# Altium project ECE453-F22-MCU.PrjPcb (part 2 of 2)

## Sheet 06-GPS.SchDoc
size A; SheetNumber: 6; SheetTotal: 10
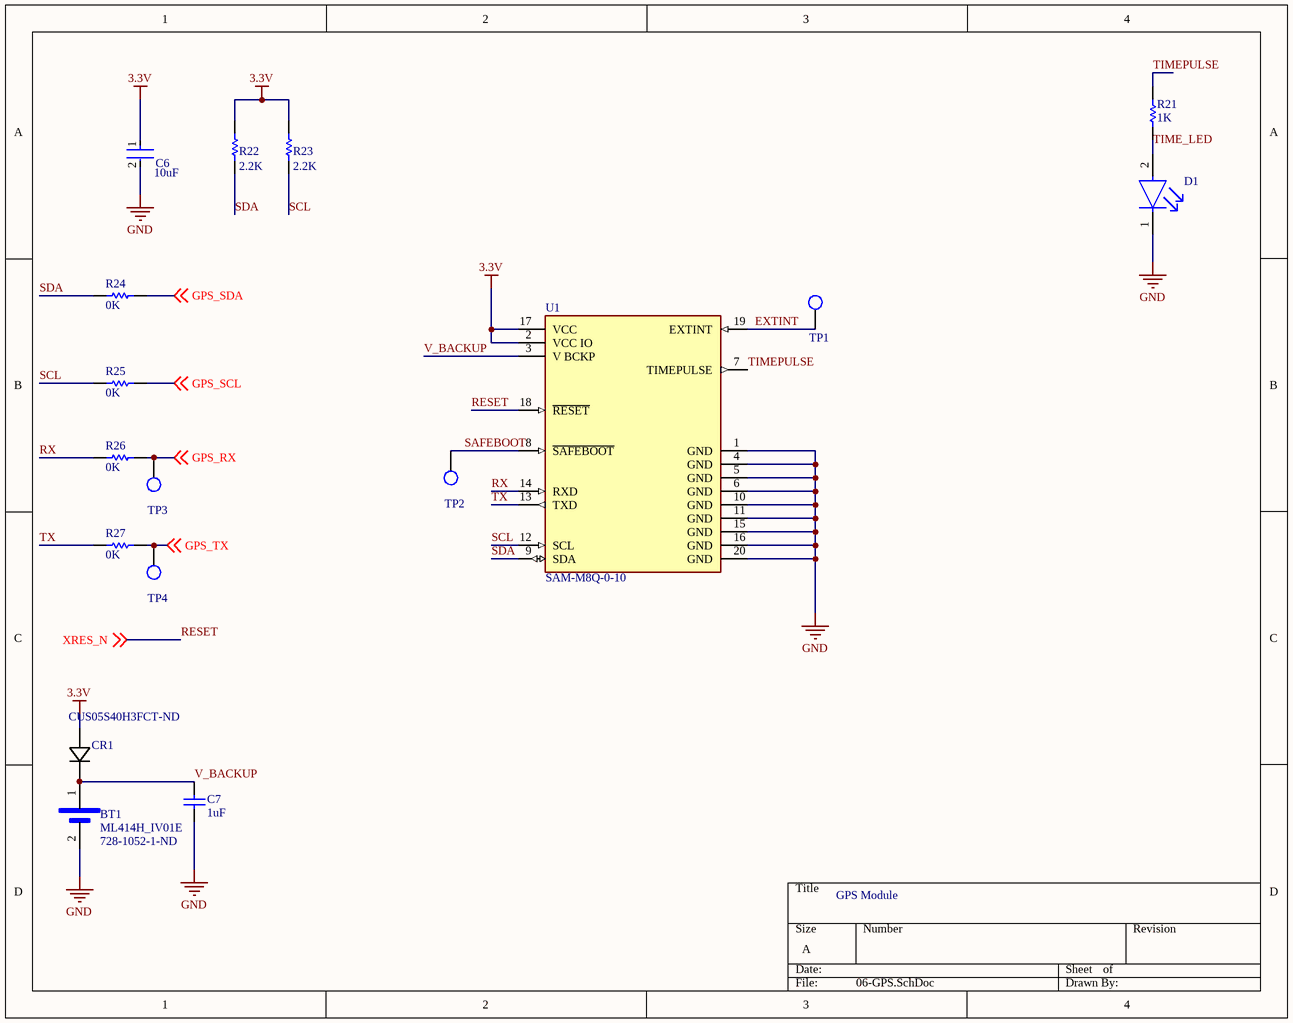
[diagram p5: 06-GPS.SchDoc]

### Parts
BT1  ML414H_IV01E  Supplier Part Number 1: 728-1052-1-ND  [SEIKO_ML414H_IV01E]
C6  Capacitance: 10uF  [FP-CL21-IPC_B]  (hidden comment: CL21A106KQCLNNC)
C7  1uF  [CAPC2013X145X50LL20T25]
CR1  Supplier Part Number 1: CUS05S40H3FCT-ND  [USC_TOS]  (hidden comment: CUS05S40)
D1  APHCM2012SYCK-F01  [FP-APHCM2012SYCK-F01-MFG]  (value not drawn)
R21  1K  [RESC2013X60X35ML10T20]
R22  2.2K  [RESC2013X70X40LL20T20]
R23  2.2K  [RESC2013X70X40LL20T20]
R24  0K  [RESC2013X50X30LL20T20]
R25  0K  [RESC2013X50X30LL20T20]
R26  0K  [RESC2013X50X30LL20T20]
R27  0K  [RESC2013X50X30LL20T20]
TP1  TP_1206  [TP-SMC-1206]  (value not drawn)
TP2  TP_1206  [TP-SMC-1206]  (value not drawn)
TP3  TP_1206  [TP-SMC-1206]  (value not drawn)
TP4  TP_1206  [TP-SMC-1206]  (value not drawn)
U1  SAM-M8Q-0-10  [FP-SAM-M8Q-0-10-MFG]

### Nets
3.3V: C6.1 CR1.2(anode) R22.2 R23.2 U1.2(VCC_IO) U1.17(VCC)
GND: BT1.2(NEG) C6.2 C7.2 D1.1(C) U1.1(GND) U1.4(GND) U1.5(GND) U1.6(GND) U1.10(GND) U1.11(GND) U1.15(GND) U1.16(GND) U1.20(GND)
EXTINT: TP1.1 U1.19(EXTINT)
GPS_RX: R24.2 R26.2 TP3.1 ; off-sheet GPS_SDA, off-sheet GPS_RX  [also labelled GPS_SDA]
GPS_SCL: R25.2 R27.2 TP4.1 ; off-sheet GPS_SCL, off-sheet GPS_TX  [also labelled GPS_TX]
RESET: U1.18(~{RESET}) ; off-sheet XRES_N  [also labelled XRES_N]
RX: R26.1 U1.14(RXD)
SAFEBOOT: TP2.1 U1.8(~{SAFEBOOT})
SCL: R23.1 R25.1 U1.12(SCL)
SDA: R22.1 R24.1 U1.9(SDA)
TIME_LED: D1.2(A) R21.1
TIMEPULSE: R21.2 U1.7(TIMEPULSE)
TX: R27.1 U1.13(TXD)
V_BACKUP: BT1.1(POS) C7.1 CR1.1(cathode) U1.3(V_BCKP)

### Notes on the sheet
- GPS Module

### Library data of the parts
BT1 = ML414H_IV01E: Coin, 4.8mm 3V Lithium Battery Rechargeable _Secondary_ 1mAh; MP: ML414H IV01E; MF: Seiko Instruments; Package: SOT-89 Seiko; SnapEDA_Link: https://www.snapeda.com/parts/ML414H%20IV01E/Seiko%20Instruments/view-part/1015565/?ref=snap; Availability: Unavailable; Price: None; Value: *; Supplier 1: Digi-Key
C6 = CMP-13271-003047-1: CL21 Series 0805 10uF 6.3V ±10% Tolerance X5R Multilayer Ceramic Chip Capacitor; Lead Free: Lead Free; Mount: Surface Mount; Case/Package: 0805; Packaging: Tape and Reel; Max Operating Temperature: 85°C; Min Operating Temperature: -55°C; Voltage Rating: 6.3V; Case Code (Metric): 2012; Radiation Hardening: No; Tolerance: 10%; Package Quantity: 1; Depth: 1.25mm; Width: 0.049inch; Dielectric: X5R; Height: 0.85mm; Case Code (Imperial): 0805; Length: 2mm; Thickness: 0.037inch
C7 = CMP-1036-04746-2: Manufacturer: Kemet; Part Number: C0805C105K4PACTU
CR1 = CUS05S40: No Description Available; Mfr_Name: Toshiba Electronic Devices & Storage Corp.; Type: DEV; Copyright: Copyright (C) 2022 Ultra Librarian. All rights reserved.; Manufacturer_Part_Number: CUS05S40; Digi-Key_Part_Number_1: CUS05S40H3FCT-ND; Digi-Key_Part_Number_2: CUS05S40H3FDKR-ND; Digi-Key_Part_Number_3: CUS05S40H3FTR-ND; RefDes: RefDes; Supplier 1: Digi-Key
D1 = CMP-44529-000064-1: LED YELLOW CLEAR CHIP SMD; Number of LEDs: 1; Luminous Intensity: 150mcd; Dominant Wavelength: 590nm; Test Current: 20mA; Illumination Color: Green; Forward Voltage: 2V; Viewing Angle: 110°; Number of Pins: 2; Packaging: Tape and Reel; Width: 1.25mm; Height: 0.4mm; Lens Color: Clear; RoHS Compliant: Yes; Lead Free: Lead Free; Min Operating Temperature: -40°C; Case Code (Imperial): 0805; Case/Package: 0805; Series: APHCM; Wavelength: 590nm; Max Operating Temperature: 85°C; Length: 2mm; Color: Yellow; Package Quantity: 2000; Mount: Surface Mount; Lens Style: Clear; Forward Current: 20mA; Case Code (Metric): 2012
R21 = CMP-2100-03671-1: Chip Resistor, 1 KOhm, +/- 1%, 125 mW, -55 to 155 degC, 0805 (2012 Metric), RoHS, Tape and Reel; Manufacturer: Yageo; Temperature Coefficient: 100ppm/degreesC; Voltage Rating (DC): 150V; Max Power Dissipation: 125mW; Resistance: 1KOhm; Number of Pins: 2; Number of Terminations: 2; Datasheet URL: http://www.yageo.com/NewPortal/yageodocoutput?fileName=/pdf/R-Chip/PYu-RC_Group_51_RoHS_L_5.pdf; Length: 0.079inch; Package Description: 2-Pin Surface Mounted Device, Body 2 x 1.25 mm; Depth: 1.25mm; Height: 0.024inch; Military Standard: Not; Case/Package: 0805; Package Reference: 0805; RoHSCompliant: true; Lead Free: LeadFree; Packaging: TapeandReel; Package Quantity: 1; Datasheet Version: Rev. 5, 10/2016; Tolerance: 1%; Min Operating Temperature: -55degC; Voltage Rating: 150V; Composition: ThickFilm; Case Code (Imperial): 0805; Power Rating: 125mW; Width: 0.049inch; Case Code (Metric): 2012; Manufacturer URL: http://www.yageo.com/; Max Operating Temperature: 155degC; REACH SVHC: Unknown; Termination: SMD/SMT
R22 R23 = CMP-2001-00376-1: ERJ-6GEYJ222V; Manufacturer: Panasonic; Part Number: ERJ-6GEYJ222V
R24-R27 = CMP-2001-04896-1: Manufacturer: Vishay Dale; Part Number: CRCW08050000Z0EA
TP1-TP4 = TP_1206: Test Point SMD 1206; Manufacturer: TE Connectivity (Tyco Electronics); Manufacturer Part Number: 1625854-1; Resistance Value: 0 Ohm; Temperature Coefficient: N/R; Supplier: Digi-Key; Stock 1: 31937; Pricing 1: 1=0.28, 10=0.261, 25=0.224, 50=0.1902, 100=0.1828, 250=0.1641, 500=0.1567, 1000=0.1306 (USD); Case Size: 1206; Dimension: 3.2 x 1.6 x 1.25mm; Family: RC; Mounting: Surface Mount; Operating Temperature: -55 to 125 C; Part No: 1625854-1; RoHS: Yes; Packaging: Tape and Reel; Termination Style: N/R; Terminal Pitch: N/R; Power Rating: N/R; Tolerance: N/R; ComponentLink1URL: https://datasheet.ciiva.com/6439/eng-ds-1773266-a-6439169.pdf; ComponentLink1Description: https://datasheet.ciiva.com/6439/eng-ds-1773266-a-6439169.pdf; ComponentLink2URL: https://datasheet.ciiva.com/30136/1773266-a-30136341.pdf; ComponentLink2Description: https://datasheet.ciiva.com/30136/1773266-a-30136341.pdf; ComponentLink3URL: https://datasheet.ciiva.com/6439/eng-ds-1773266-a-6439080.pdf; ComponentLink3Description: https://datasheet.ciiva.com/6439/eng-ds-1773266-a-6439080.pdf; ComponentLink4URL: https://datasheet.ciiva.com/6439/eng-ds-1773266-a-6439081.pdf; ComponentLink4Description: https://datasheet.ciiva.com/6439/eng-ds-1773266-a-6439081.pdf; ComponentLink5URL: https://datasheet.ciiva.com/6439/eng-ds-1773266-a-6439083.pdf; ComponentLink5Description: https://datasheet.ciiva.com/6439/eng-ds-1773266-a-6439083.pdf; Supplier Part Number: A106143CT-ND; Supplier 1: Digi-Key; Supplier Part Number 1: A106143CT-ND
U1 = CMP-207130-000004-3: RF RX GALILEO 1.575GHZ/1.602GHZ; Manufacturer: uBlox; Nominal Supply Current: 9.5-32mA; Sensitivity: -165dBm; Automotive Grade: Grade 3; Max Frequency: 1602MHz; Min Supply Voltage: 2.7V; Max Supply Voltage: 3.6V; Data Rate: 400kbits/s; Interface: I2C,UART,Other; Package: 0; ComponentLink2Description: Datasheet; Octopart: https://octopart.com/sam-m8q-0-10-u-blox-88247750; Temperature Range Low: -40°C; Height: 6.8mm; Category: IC; RoHS: TRUE; Digikey Description: RF RX GALILEO 1.575GHZ/1.602GHZ; Footprint Url: https://www.u-blox.com/sites/default/files/SAM-M8Q_HardwareIntegrationManual_%28UBX-16018358%29.pdf; ComponentLink2URL: https://www.u-blox.com/sites/default/files/SAM-M8Q_DataSheet_%28UBX-16012619%29.pdf; Temperature Range High: +85°C; Device Class L1: Integrated Circuits (ICs); Temperature: -40°C to +85°C; Automotive: Yes; Device Class L2: RF Semiconductors and Devices; Manufacturer Part Number: SAM-M8Q-0-10; Device Class L3: Transceivers; Lead Free: Yes

## Sheet 07-3V3_Monitor.SchDoc
size A; SheetNumber: 7; SheetTotal: 9
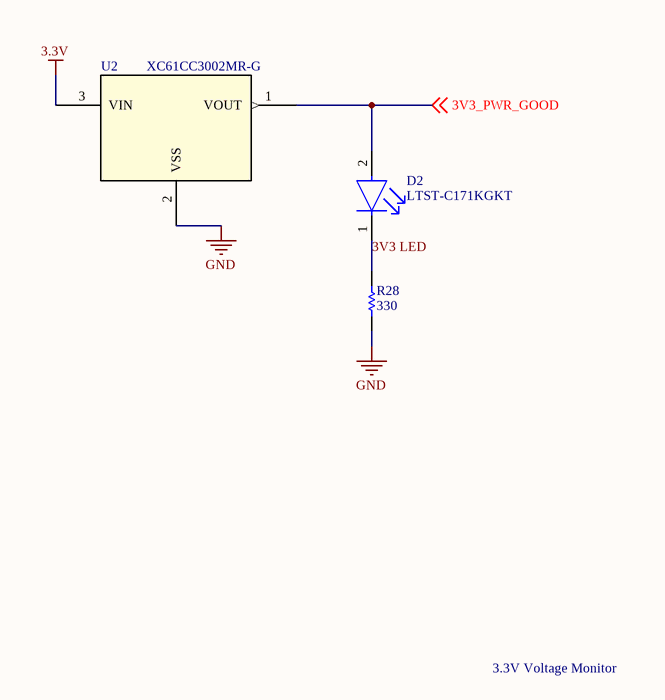
[diagram p6: 07-3V3_Monitor.SchDoc]

### Parts
D2  LTST-C171KGKT  [FP-LTST-C171KGKT-MFG]
R28  330  [RES_0805]
U2  XC61CC3002MR-G  [XC61C_SOT-23_TOR]

### Nets
3.3V: U2.3(VIN)
GND: R28.1 U2.2(VSS)
3V3 LED: D2.1(C) R28.2
3V3_PWR_GOOD: D2.2(A) U2.1(VOUT) ; off-sheet 3V3_PWR_GOOD

### Notes on the sheet
- 3.3V Voltage Monitor

### Library data of the parts
D2 = CMP-22017-000037-1: LED GREEN CLEAR SMD; Number of LEDs: 1; Viewing Angle: 130°; Lens Style: Rectangular; Dominant Wavelength: 571nm; Test Current: 20mA; Luminous Intensity: 35mcd; Power Rating: 75mW; Forward Voltage: 2.4V; Forward Current: 30mA; Reverse Voltage: 5V; Lens Color: Colorless; Wavelength: 574nm; Height: 0.8mm; Illumination Color: Green; Length: 2mm; Case/Package: 0805; Number of Pins: 2; Number of Elements: 1; Package Quantity: 1; Depth: 1.25mm; Lens Transparency: Clear; Width: 1.25mm; Color: Green; Radiation Hardening: No; Mount: Surface Mount; Packaging: Tape and Reel; Case Code (Metric): 2012; Lead Free: Lead Free; Max Operating Temperature: 85°C; Min Operating Temperature: -55°C; Case Code (Imperial): 0805; Power Dissipation: 75mW
R28 = RES_0805_R_330.00: RES 330 OHM 1% 1/8W 0805; Manufacturer 1: Stackpole Electronics; Manufacturer Part Number 1: RMCF0805FT330R; Temperature Coefficient: 100ppm/°C; Resistance: 330R; Max Power Dissipation: 125mW; Features: Automotive AEC-Q200; Number of Terminations: 2; RoHS: Yes; Packaging: Tape and Reel; Tolerance: 1%; Category: Chip SMD Resistors; Supplier 1: Digi-Key; Supplier Part Number 1: RMCF0805FT330RCT-ND; Stock 1: 205996; Pricing 1: 1=0.10000, 10=0.02700, 100=0.01090, 1000=0.00488, 2500=0.00423 (USD); Mount: Surface Mount; Case/Package: 0805; Case Code (Metric): 2012; Case Code (Imperial): 0805; Contact Plating: Tin,Matte; Min Operating Temperature: -55°C; Max Operating Temperature: 155°C; Resistor Type: Thick Film; Series: RMCF; Construction: Rectangular; Length: 0.079inch; Width: 0.049inch; Height: 0.026inch; Depth: 1.25mm; Radiation Hardening: No; Military Standard: Not; Lead Free: Lead Free; RoHS Compliant: Yes; ComponentLink1URL: http://components.arrow.com/part/dataview/40963487S9848862N1174?src-supplier=Arrow+Electronics; ComponentLink1Description: http://components.arrow.com/part/dataview/40963487S9848862N1174?src-supplier=Arrow+Electronics; ComponentLink2URL: https://www.seielect.com/catalog/SEI-RMCF_RMCP.pdf?src-supplier=Avnet; ComponentLink2Description: https://www.seielect.com/catalog/SEI-RMCF_RMCP.pdf?src-supplier=Avnet; ComponentLink3URL: https://www.seielect.com/Catalog/SEI-RMCF_RMCP.pdf?src-supplier=Digi-Key; ComponentLink3Description: https://www.seielect.com/Catalog/SEI-RMCF_RMCP.pdf?src-supplier=Digi-Key; ComponentLink4URL: https://www.seielect.com/catalog/SEI-Packaging.pdf?src-supplier=Digi-Key; ComponentLink4Description: https://www.seielect.com/catalog/SEI-Packaging.pdf?src-supplier=Digi-Key; ComponentLink5URL: https://www.verical.com/server-webapp/html/getDatasheet?partID=559884&src-supplier=Verical; ComponentLink5Description: https://www.verical.com/server-webapp/html/getDatasheet?partID=559884&src-supplier=Verical
U2 = XC61CC3002MR-G: IC SUPERVISOR 1 CHANNEL SOT23; Mfr_Name: Torex Semiconductor; Copyright: Copyright (C) 2022 Ultra Librarian. All rights reserved.; Manufacturer_Part_Number: XC61CC3002MR-G; Digi-Key_Part_Number_1: 893-1029-1-ND; Digi-Key_Part_Number_2: 893-1029-2-ND; Digi-Key_Part_Number_3: 893-1029-6-ND; RefDes: RefDes; Type: DEV; Supplier 1: Digi-Key; Supplier Part Number 1: 893-1029-1-ND

## Sheet 08-Power_3V3.SchDoc: ECE453 Power
size A; Date: 4/25/2017; ApprovedBy: JSK; CheckedBy: JSK; Author: JSK; CompanyName: University of Wisconsin; DrawnBy: JSK; Engineer: JSK; Organization: ECE 315; Address1: College of Engineering; Address2: 1415 Engineering Drive; Address3: Madison, WI 53706; Address4: ECE 453 Fall 2022; Revision: A; SheetNumber: 8; SheetTotal: 10; AssemblyNumber: ECE453-F22-01
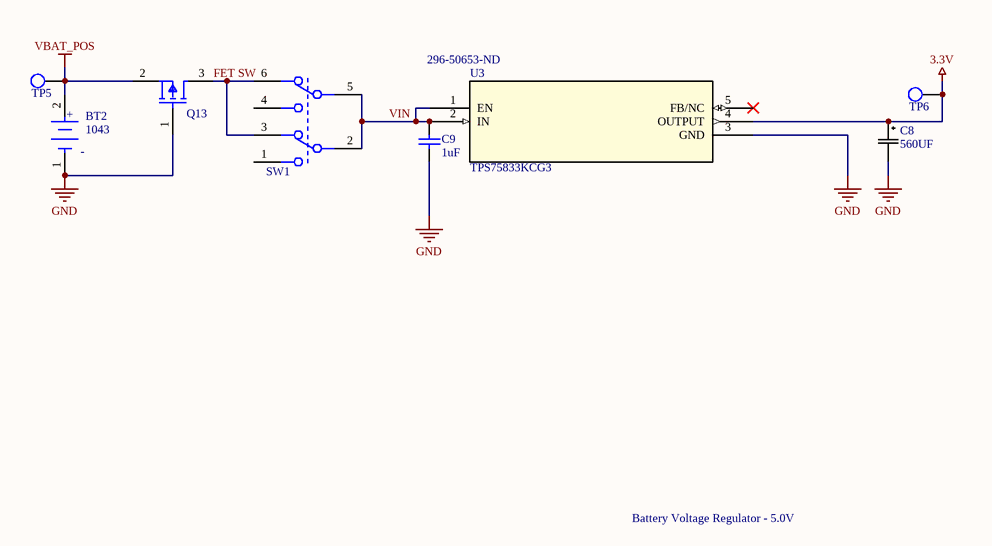
[diagram p7: 08-Power_3V3.SchDoc]

### Parts
BT2  1043  [Keystone_1043_0]
C8  560UF  [CAP_RHA/HS_8X7P7_NCH]
C9  1uF  [CAPC2013X145X50LL20T25]
Q13  SSM3J328R,LF  [SOT-23_M]  (value not drawn)
SW1  JS202011SCQN  [C&K_Components_0_MFG]  (value not drawn)
TP5  TP_1206  [TP-SMC-1206]  (value not drawn)
TP6  TP_1206  [TP-SMC-1206]  (value not drawn)
U3  TPS75833KCG3  Supplier Part Number 1: 296-50653-ND  [KC5]

### Nets
3.3V: C8.1 TP6.1 U3.4(OUTPUT)
GND: BT2.1(C) C8.2 C9.2 Q13.1(Gate) U3.3(GND)
VBAT_POS: BT2.2(A) Q13.2(Source) TP5.1
FET SW: Q13.3(Drain) SW1.3 SW1.6
VIN: C9.1 SW1.2 SW1.5 U3.1(EN) U3.2(IN)

Not connected (* = marked no-connect by the designer): SW1 1 4; U3 5(FB/NC)*

### Notes on the sheet
- Battery Voltage Regulator - 5.0V
- (in symbol 1043) +; -

### Library data of the parts
BT2 = 1043: Cylindrical Battery Contacts, Clips, Holders & Springs 18650 PCB PLASTIC BATT HLDR THM 1 CELL; Manufacturer 1: Keystone Electronics; Body Material: Nylon; Number of Cells: 1; Supplier 1: Digi-Key; Supplier Part Number 1: 36-1043-ND; RoHS: Yes; Category: Passive Components; Stock 1: 3564; Pricing 1: 1=3.00000, 25=2.52400, 100=2.08850, 250=1.92020, 500=1.80144 (USD); Mount: Through Hole,PCB; Number of Pins: 1; Contact Plating: Gold; Material: Nylon; Contact Material: Stainless Steel; Min Operating Temperature: -50°C; Max Operating Temperature: 145°C; Package Quantity: 100; Packaging: Tray; Termination: PC Pin; ComponentLink1URL: https://datasheet.ciiva.com/4/1043-4710.pdf?src-supplier=Digi-Key; ComponentLink1Description: https://datasheet.ciiva.com/4/1043-4710.pdf?src-supplier=Digi-Key; ComponentLink2URL: https://datasheet.ciiva.com/3353/1043-eng-tds-3353208.pdf?src-supplier=Distrelec; ComponentLink2Description: https://datasheet.ciiva.com/3353/1043-eng-tds-3353208.pdf?src-supplier=Distrelec; ComponentLink3URL: https://datasheet.ciiva.com/41803/1043-41803215.pdf?src-supplier=Digi-Key; ComponentLink3Description: https://datasheet.ciiva.com/41803/1043-41803215.pdf?src-supplier=Digi-Key; ComponentLink4URL: https://datasheet.ciiva.com/4642/1043-4642493.pdf?src-supplier=Mouser; ComponentLink4Description: https://datasheet.ciiva.com/4642/1043-4642493.pdf?src-supplier=Mouser; Manufacturer Part Number 1: 1043
C8 = RHA0J561MCN1GS: CAP ALUM POLY 560UF 20% 6.3V SMD; Mfr_Name: Nichicon; Type: DEV; Copyright: Copyright (C) 2022 Ultra Librarian. All rights reserved.; Manufacturer_Part_Number: RHA0J561MCN1GS; Digi-Key_Part_Number_1: 493-3772-1-ND; Digi-Key_Part_Number_2: 493-3772-2-ND; Digi-Key_Part_Number_3: 493-3772-6-ND; RefDes: RefDes; Supplier 1: Digi-Key; Supplier Part Number 1: 493-3772-1-ND
C9 = CMP-1036-04746-2: as C7 on sheet 06-GPS
Q13 = SSM3J328R,LF: MOSFET P-CH 20V 6A SOT23F; Manufacturer 1: Toshiba; Rds On Max: 29.8mR; Input Capacitance: 840pF; Max Power Dissipation: 1W; Gate to Source Voltage (Vgs): 8V; Turn-Off Delay Time: 107ns; Turn-On Delay Time: 32ns; Number of Channels: 1; Drain to Source Resistance: 47.4mR; Power Dissipation: 2W; Element Configuration: Single; Drain to Source Breakdown Voltage: -20V; Polarity: P-CHANNEL; Supplier 1: Digi-Key; Supplier Part Number 1: SSM3J328RLFCT-ND; Manufacturer Part Number 1: SSM3J328R,LF; RoHS: Yes; Category: MOSFETs; Stock 1: 476474; Pricing 1: 1=0.43000, 10=0.32200, 25=0.29040, 100=0.20060, 500=0.13728, 1000=0.10560 (USD); Mount: Surface Mount; Case/Package: SOT-23-3; Number of Pins: 3; Min Operating Temperature: -55°C; Max Operating Temperature: 150°C; Package Quantity: 3000; Packaging: Tape and Reel; Drain to Source Voltage (Vdss): 20V; Continuous Drain Current (ID): 6A; Number of Elements: 1; Radiation Hardening: No; RoHS Compliant: Yes; ComponentLink1URL: https://datasheet.ciiva.com/11158/ssm3j328r-datasheet-en-20140301-11158652.pdf?src-supplier=Avnet; ComponentLink1Description: https://datasheet.ciiva.com/11158/ssm3j328r-datasheet-en-20140301-11158652.pdf?src-supplier=Avnet; ComponentLink2URL: https://datasheet.ciiva.com/24106/ssm3j328r-datasheet-en-20140301-24106699.pdf?src-supplier=Mouser; ComponentLink2Description: https://datasheet.ciiva.com/24106/ssm3j328r-datasheet-en-20140301-24106699.pdf?src-supplier=Mouser; ComponentLink3URL: https://datasheet.ciiva.com/45425/ssm3j328r-datasheet-en-20140301-45425519.pdf?src-supplier=Digi-Key; ComponentLink3Description: https://datasheet.ciiva.com/45425/ssm3j328r-datasheet-en-20140301-45425519.pdf?src-supplier=Digi-Key; ComponentLink4URL: https://datasheet.ciiva.com/45425/ssm3j328r-datasheet-en-20140301-45425813.pdf?src-supplier=Digi-Key; ComponentLink4Description: https://datasheet.ciiva.com/45425/ssm3j328r-datasheet-en-20140301-45425813.pdf?src-supplier=Digi-Key
SW1 = JS202011SCQN: C & K COMPONENTS - JS202011SCQN - SWITCH, DPDT, 0.6A, 6VDC, SMD; Manufacturer 1: ITT C&K; Actuator Material: Nylon,Polyamide,PA46; Actuator Color: Black; Voltage Rating (DC): 6V; Current Rating: 300mA; Electrical Life: 5000Cycles; Switch Function: On-On; Contact Resistance: 70mR; Switch Travel: 2mm; Actuator Type: Standard; Supplier 1: Digi-Key; Supplier Part Number 1: 401-2002-1-ND; Manufacturer Part Number 1: JS202011SCQN; RoHS: Yes; Category: Slide Switches; Stock 1: 21096; Pricing 1: 1=0.55000, 10=0.53000, 25=0.51040, 100=0.44180, 250=0.40252, 500=0.37306 (USD); Mount: Surface Mount; Contact Plating: Silver; Contact Material: Copper Alloy; Housing Material: Nylon; Min Operating Temperature: -20°C; Max Operating Temperature: 85°C; Throw Configuration: DPDT; Packaging: Tape and Reel; Package Quantity: 1; Termination: Gull Wing; Max Voltage Rating (DC): 6V; Series: JS; Max Current Rating: 300mA; Contact Current Rating: 300mA; Orientation: Vertical; Length: 9mm; Depth: 7.5mm; Actuator Length: 2mm; Radiation Hardening: No; REACH SVHC: No SVHC; Lead Free: Lead Free; Flammability Rating: UL94 V-2; ComponentLink1URL: https://datasheet.ciiva.com/2889/js-29aug13-2889127.pdf?src-supplier=Digi-Key; ComponentLink1Description: https://datasheet.ciiva.com/2889/js-29aug13-2889127.pdf?src-supplier=Digi-Key; ComponentLink2URL: https://datasheet.ciiva.com/23829/1707718-23829488.pdf?src-supplier=Newark; ComponentLink2Description: https://datasheet.ciiva.com/23829/1707718-23829488.pdf?src-supplier=Newark; ComponentLink3URL: https://datasheet.ciiva.com/8625/js-9dec14-8625470.pdf?src-supplier=Avnet; ComponentLink3Description: https://datasheet.ciiva.com/8625/js-9dec14-8625470.pdf?src-supplier=Avnet; ComponentLink4URL: https://datasheet.ciiva.com/2889/js-15sept15-2889128.pdf?src-supplier=Digi-Key; ComponentLink4Description: https://datasheet.ciiva.com/2889/js-15sept15-2889128.pdf?src-supplier=Digi-Key; ComponentLink5URL: https://datasheet.ciiva.com/2889/js-15sept15-2889129.pdf?src-supplier=Digi-Key; ComponentLink5Description: https://datasheet.ciiva.com/2889/js-15sept15-2889129.pdf?src-supplier=Digi-Key; ComponentLink6URL: https://datasheet.ciiva.com/22630/1707718-22630697.pdf?src-supplier=Element14; ComponentLink6Description: https://datasheet.ciiva.com/22630/1707718-22630697.pdf?src-supplier=Element14
TP5 TP6 = TP_1206: as TP1 on sheet 06-GPS; Supplier: Digi-Key; Stock 1: 31937; Pricing 1: 1=0.28, 10=0.261, 25=0.224, 50=0.1902, 100=0.1828, 250=0.1641, 500=0.1567, 1000=0.1306 (USD); Case Size: 1206; Dimension: 3.2 x 1.6 x 1.25mm; Family: RC; Mounting: Surface Mount; Operating Temperature: -55 to 125 C; Part No: 1625854-1; RoHS: Yes; Packaging: Tape and Reel; Termination Style: N/R; Terminal Pitch: N/R; Power Rating: N/R; Tolerance: N/R; ComponentLink1URL: https://datasheet.ciiva.com/6439/eng-ds-1773266-a-6439169.pdf; ComponentLink1Description: https://datasheet.ciiva.com/6439/eng-ds-1773266-a-6439169.pdf; ComponentLink2URL: https://datasheet.ciiva.com/30136/1773266-a-30136341.pdf; ComponentLink2Description: https://datasheet.ciiva.com/30136/1773266-a-30136341.pdf; ComponentLink3URL: https://datasheet.ciiva.com/6439/eng-ds-1773266-a-6439080.pdf; ComponentLink3Description: https://datasheet.ciiva.com/6439/eng-ds-1773266-a-6439080.pdf; ComponentLink4URL: https://datasheet.ciiva.com/6439/eng-ds-1773266-a-6439081.pdf; ComponentLink4Description: https://datasheet.ciiva.com/6439/eng-ds-1773266-a-6439081.pdf; ComponentLink5URL: https://datasheet.ciiva.com/6439/eng-ds-1773266-a-6439083.pdf; ComponentLink5Description: https://datasheet.ciiva.com/6439/eng-ds-1773266-a-6439083.pdf; Supplier Part Number: A106143CT-ND; Supplier 1: Digi-Key; Supplier Part Number 1: A106143CT-ND
U3 = TPS75833KCG3: IC REG LINEAR 3.3V 3A TO220-5; Mfr_Name: Texas Instruments; Copyright: Copyright (C) 2022 Ultra Librarian. All rights reserved.; Manufacturer_Part_Number: TPS75833KCG3; Digi-Key_Part_Number_1: 296-50653-ND; Digi-Key_Part_Number_2: TPS75833KCG3-ND; RefDes: RefDes; Type: DEV; Supplier 1: Digi-Key

## Sheet 09-Transmitter.SchDoc
size A; SheetNumber: 9; SheetTotal: 10
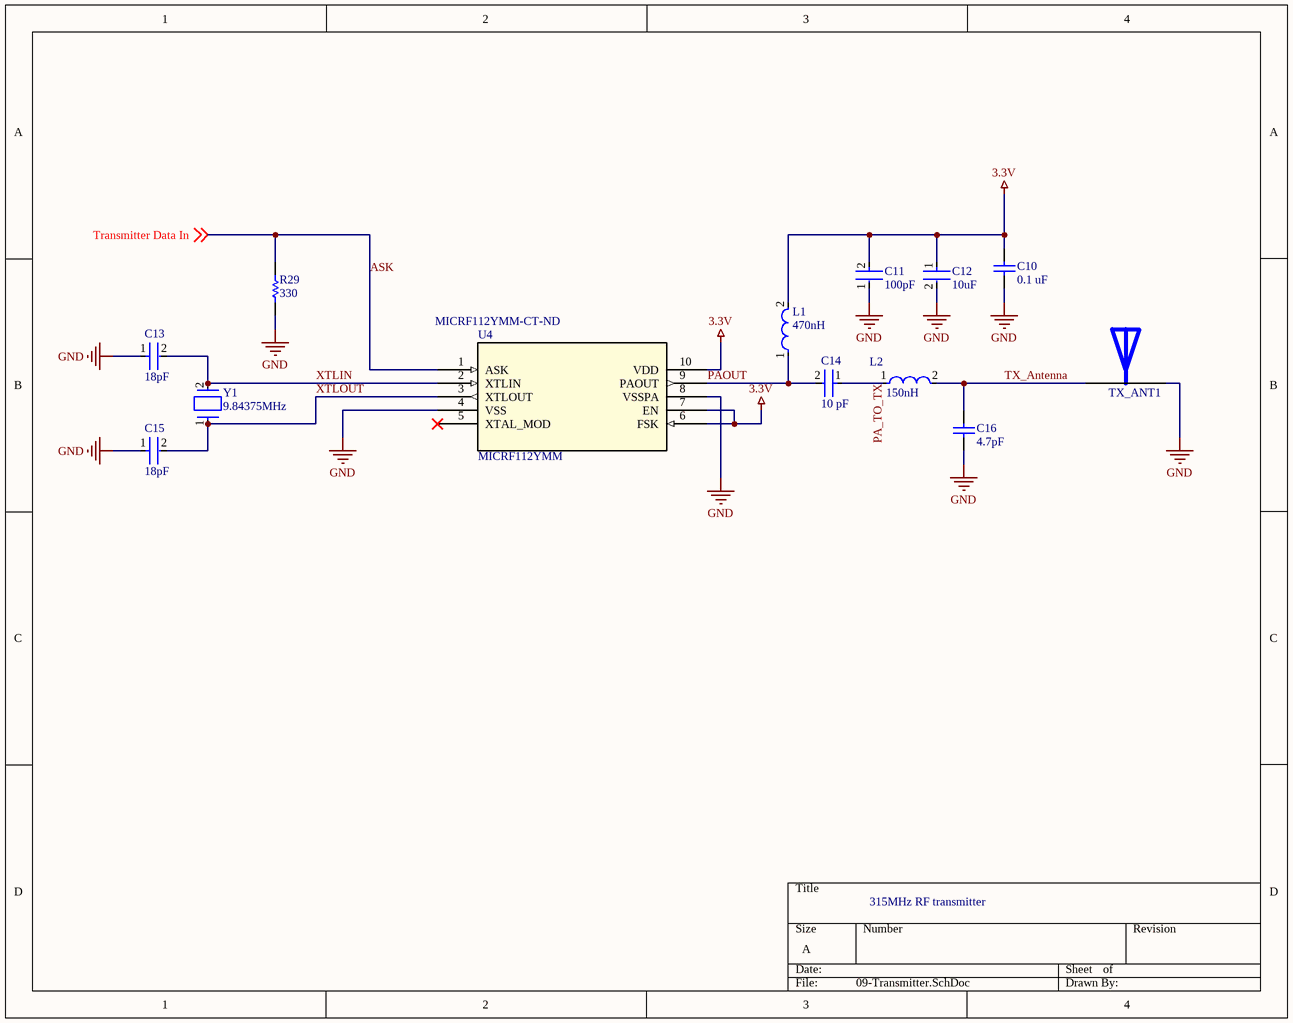
[diagram p8: 09-Transmitter.SchDoc]

### Parts
C10  0.1 uF  [CAPC2013X135X45ML10T25]
C11  100pF  [FP-C0805C-DN-MFG]
C12  10uF  [FP-C0805C-DG-MFG]
C13  18pF  [FP-C0805C-DN-MFG]
C14  10 pF  [FP-C0805C-DN-MFG]
C15  18pF  [FP-C0805C-DN-MFG]
C16  4.7pF  [CAPC2013X140X50NL20T25]
L1  470nH  [FP-LQW2UAS_00-MFG]
L2  150nH  [FP-LQW2BHN_03-MFG]
R29  330  [RESC2013X60X35ML10T20]
TX_ANT1  TX Antenna  [TX_Antenna]  (value not drawn)
U4  MICRF112YMM  Supplier Part Number 1: MICRF112YMM-CT-ND  [MSOP10_MC_MCH]
Y1  9.84375MHz  [FP-ABM7-MFG]

### Nets
3.3V: C10.1 C11.2 C12.1 L1.2 U4.6(FSK) U4.7(EN) U4.10(VDD)
GND: C10.2 C11.1 C12.2 C13.1 C15.1 C16.1 R29.1 TX_ANT1.2 U4.4(VSS) U4.8(VSSPA)
ASK: R29.2 U4.1(ASK) ; off-sheet Transmitter Data In  [also labelled Transmitter Data In]
PA_TO_TX: C14.1 L2.1
PAOUT: C14.2 L1.1 U4.9(PAOUT)
TX_Antenna: C16.2 L2.2 TX_ANT1.1
XTLIN: C13.2 U4.2(XTLIN) Y1.2
XTLOUT: C15.2 U4.3(XTLOUT) Y1.1

Not connected (* = marked no-connect by the designer): U4 5(XTAL_MOD)*

### Notes on the sheet
- 315MHz RF transmitter

### Library data of the parts
C10 = CMP-2100-03644-1: Chip Capacitor, 0.1 uF, +/- 10%, 50 V, -55 to 125 degC, 0805 (2012 Metric), RoHS, Tape and Reel; Manufacturer: Murata; Voltage: 50V; Capacitance: 100nF; Insulation Resistance: 10GR; Dielectric Material: Ceramic; Dielectric: X7R; Package Description: 2-Pin Surface Mount Device, Body 2 x 1.25 mm; Manufacturer URL: http://www.murata.com/; Case Code (Imperial): 0805; Datasheet URL: http://psearch.en.murata.com/capacitor/product/GRM21BR71H104KA01%23.pdf; Termination: SMD/SMT; Lead Free: LeadFree; Package Quantity: 1; Mount: SurfaceMount; REACH SVHC: Unknown; Thickness: 0.053inch; Height: 1.25mm; Case/Package: 0805; Voltage Rating: 50V; Width: 0.049inch; Case Code (Metric): 2012; Material: Ceramic; Min Operating Temperature: -55degC; RoHSCompliant: true; Datasheet Version: 42675.0; Voltage Rating (DC): 50V; Tolerance: 10%; Package Reference: 0805; Depth: 1.25mm; Length: 2mm; Max Operating Temperature: 125degC; Packaging: TapeandReel; Number of Pins: 2; Radiation Hardening: No
C11 = CMP-03020-013647-1: CAP CER 100PF 50V C0G/NP0 0805; Manufacturer Part Number: C0805C101J5GACTU; Manufacturer: KEMET; Temperature Characteristic: C0G; Tolerance: 0.05; Material: Ceramic; Temperature Coefficient: 30ppm/°C; Temperature Range High: +125°C; Voltage Rating: 50 V; Device Class L1: Passive Components; Category: Cap; Capacitance: 100 pF; Temperature Range Low: -55°C; Height: 0.88mm; Package: C0805C-DN; Device Class L2: Capacitors; Octopart: https://octopart.com/c0805c101j5gactu-kemet-100795; Ipc Land Pattern Name: CAPC200125X78; Value: 100 pF; RoHS: TRUE; Temperature: -55°C to +125°C; Lead Free: Yes; Automotive: No; ComponentLink2URL: https://content.kemet.com/datasheets/KEM_C1003_C0G_SMD.pdf; ComponentLink2Description: Datasheet; Digikey Description: CAP CER 100PF 50V C0G/NP0 0805; Device Class L3: Ceramic Capacitors
C12 = CMP-2007-03243-2: CAP CER 10UF 10V X5R 0805; Manufacturer Part Number: C0805C106K8PACTU; Manufacturer: Kemet; 3DS Part Number: 220-00001; Tolerance: 10%; Temperature Coefficient: 15%; Material: Ceramic; Device Class L2: Capacitors; Device Class L1: Passive Components; ComponentLink2URL: https://content.kemet.com/datasheets/KEM_C1006_X5R_SMD.pdf; Height: 1.4mm; Lead Free: Yes; Digikey Description: CAP CER 10UF 10V X5R 0805; Octopart: https://octopart.com/c0805c106k8pactu-kemet-98697; Capacitance: 10uF; Value: 10uF; Temperature Range Low: -55°C; Temperature: -55°C to +85°C; Automotive: No; Mouser Description: CAP CER 10UF 10V X5R 0805; Ipc Land Pattern Name: CAPC200125X125; Temperature Range High: +85°C; Voltage: 10V; RoHS: TRUE; Device Class L3: Ceramic Capacitors; ComponentLink2Description: Datasheet; Voltage Rating: 10V; Package: C0805C-DG; Temperature Characteristic: X5R; Category: Cap
C13 C15 = CMP-2007-00302-2: CAP CER 18PF 50V C0G/NP0 0805; Manufacturer: KEMET; Manufacturer Part Number: C0805C180J5GACTU; Temperature Characteristic: C0G; Tolerance: 0.05; Material: Ceramic; Temperature Coefficient: 30ppm/°C; Device Class L2: Capacitors; Capacitance: 18 pF; Temperature: -55°C to +125°C; Value: 18 pF; Package: C0805C-DN; Mouser Description: Cap Ceramic 18pF 50V C0G 5% SMD 0805 125C Paper T/R; Height: 0.88mm; ComponentLink2URL: https://content.kemet.com/datasheets/KEM_C1003_C0G_SMD.pdf; RoHS: TRUE; Octopart: https://octopart.com/c0805c180j5gactu-kemet-144810; ComponentLink2Description: Datasheet; Temperature Range High: +125°C; Digikey Description: CAP CER 18PF 50V C0G/NP0 0805; Device Class L1: Passive Components; Category: Cap; Automotive: No; Device Class L3: Ceramic Capacitors; Voltage Rating: 50 V; Temperature Range Low: -55°C; Ipc Land Pattern Name: CAPC200125X78; Lead Free: Yes; Supplier Part Number 1: 399-C0805C180J5GAC7800CT-ND
C14 = CMP-2007-00219-2: Capacitor; Ceramic; Cap 10 pF; Tol 5%; Vol-Rtg 50 VDC; SMT; 0805; COG (NPO); Tape&Reel; Manufacturer Part Number: C0805C100J5GACTU; Manufacturer: KEMET; Temperature Coefficient: 30ppm/°C; Voltage Rating: 50 V; Tolerance: 0.05; Temperature Characteristic: C0G; RoHS: TRUE; Mouser Description: KEMET - C0805C100J5GACTU - CAP, MLCC, C0G/NP0, 10PF, 50V, 0805; Temperature Range High: +125°C; Octopart: https://octopart.com/c0805c100j5gactu-kemet-104357; Automotive: No; Device Class L1: Passive Components; Temperature Range Low: -55°C; Value: 10 pF; Device Class L3: Ceramic Capacitors; Material: Ceramic; Device Class L2: Capacitors; Lead Free: Yes; Category: Cap; Ipc Land Pattern Name: CAPC200125X78; ComponentLink2Description: Datasheet; ComponentLink2URL: https://content.kemet.com/datasheets/KEM_C1003_C0G_SMD.pdf; Digikey Description: Capacitor; Ceramic; Cap 10 pF; Tol 5%; Vol-Rtg 50 VDC; SMT; 0805; COG (NPO); Tape&Reel; Temperature: -55°C to +125°C; Height: 0.88mm; Capacitance: 10 pF; Package: C0805C-DN
C16 = CMP-2007-04561-1: Manufacturer: AVX Interconnect / Elco; Part Number: 08051A4R7CAT2A
L1 = CMP-06042-015512-1: Wire Wound RF Inductor 470nH ±5% 470mA 1.19Ω 1008 (2520); Test Frequency: 25MHz; DC Resistance (DCR): 1.19R; Core Material: Air; Shielding: Unshielded; Self Resonant Frequency: 450MHz; Q Factor: 45; Case Code (Metric): 2520; Packaging: Tape and Reel; Inductance: 470nH; Tolerance: 5%; Width: 0.096inch; Radiation Hardening: No; Case Code (Imperial): 1008; Resistor Type: Wirewound; Depth: 2.65mm; Min Operating Temperature: -55°C; Inductance Tolerance: 5%; Max DC Current: 470mA; Mount: Surface Mount; Series: LQW2UA; Max Operating Temperature: 125°C; REACH SVHC: No SVHC; Termination: SMD/SMT; Current Rating: 470mA; Height - Seated (Max): 0.08inch; Package Quantity: 2000; Height: 1.83mm; Lead Free: Lead Free; Length: 0.103inch; Weight: 0.001376oz; Case/Package: 1008
L2 = CMP-06042-003065-1: Wire Wound RF Inductor 150nH ±5% 390mA 0.47Ω 0805 (2015); Q Factor: 30; Shielding: Unshielded; Core Material: Non-Magnetic; Test Frequency: 100MHz; Series Resistance: 470mR; Self Resonant Frequency: 350MHz; DC Current: 390mA; Tolerance: 5%; Max DC Current: 390mA; Radiation Hardening: No; Packaging: Tape and Reel; Case/Package: 0805; Package Quantity: 2000; Length: 2mm; Case Code (Imperial): 0805; Weight: 0.000317oz; Resistor Type: Wirewound; Height - Seated (Max): 0.07inch; Depth: 1.7mm; Min Operating Temperature: -40°C; Height: 1.7mm; Lead Free: Lead Free; Current Rating: 390mA; Case Code (Metric): 2012; Military Standard: Not; Inductance: 150nH; Mount: Surface Mount; Width: 0.059inch; DC Resistance (DCR): 470mR; Termination: SMD/SMT; Max Operating Temperature: 85°C
R29 = CMP-2100-03668-1: Chip Resistor, 100 KOhm, +/- 1%, 0.125 W, -55 to 155 degC, 0805 (2012 Metric), RoHS, Tape and Reel; Manufacturer: Yageo; Max Power Dissipation: 125mW; Voltage Rating: 150V; Temperature Coefficient: 100ppm/degreesC; Manufacturer URL: http://www.yageo.com/; Min Operating Temperature: -55degC; Lead Pitch: 0.4mm; Composition: ThickFilm; Case Code (Metric): 2012; Military Standard: Not; Package Description: 2-Pin Surface Mounted Device, Body 2 x 1.25 mm; REACH SVHC: Unknown; RoHSCompliant: true; Depth: 1.25mm; Number of Pins: 2; Lead Free: LeadFree; Resistance: 100KOhm; Datasheet URL: http://www.yageo.com/NewPortal/yageodocoutput?fileName=/pdf/R-Chip/PYu-RC_Group_51_RoHS_L_5.pdf; Max Operating Temperature: 155degC; Case/Package: 0805; Package Quantity: 1; Case Code (Imperial): 0805; Power Rating: 125mW; Width: 0.049inch; Package Reference: 0805; Height: 0.024inch; Termination: SMD/SMT; Tolerance: 1%; Datasheet Version: Rev. 5, 10/2016; Length: 2mm; Voltage Rating (DC): 150V; Number of Terminations: 2; Packaging: TapeandReel
U4 = MICRF112YMM: No Description Available; Mfr_Name: Microchip; Copyright: Copyright (C) 2022 Ultra Librarian. All rights reserved.; Manufacturer_Part_Number: MICRF112YMM; RefDes: RefDes; Type: DEV; Supplier 1: Digi-Key
Y1 = CMP-27762-013556-1: Crystal 9.84375MHz ±30ppm 10pF SMD-2 6mm x 3.5mm; Frequency Stability: 100ppm; ESR (Equivalent Series Resistance): 50R; Width: 0.138inch; Mount: Surface Mount; Height: 0.055inch; Case/Package: SMD/SMT; Frequency Tolerance: 30ppm; Max Operating Temperature: 85°C; Length: 0.236inch; Min Operating Temperature: -40°C; Packaging: Tape and Reel; Frequency: 9.84375MHz; Load Capacitance: 10pF

## Sheet 10-Push_Buttons.SchDoc
size A; SheetNumber: 10; SheetTotal: 10
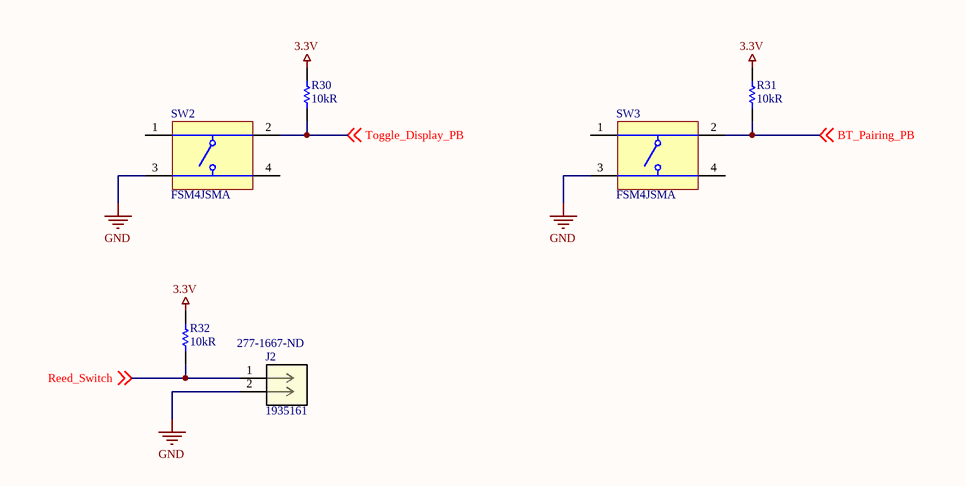
[diagram p9: 10-Push_Buttons.SchDoc]

### Parts
J2  1935161  Supplier Part Number 1: 277-1667-ND  [CONN_1935161_PXC]
R30  Resistance: 10kR  [RESC2013X60X35NL10T20]  (hidden comment: RC0805FR-0710KL)
R31  Resistance: 10kR  [RESC2013X60X35NL10T20]  (hidden comment: RC0805FR-0710KL)
R32  Resistance: 10kR  [RESC2013X60X35NL10T20]  (hidden comment: RC0805FR-0710KL)
SW2  FSM4JSMA  [TECO-FSM4JSMA_V]
SW3  FSM4JSMA  [TECO-FSM4JSMA_V]

### Nets
3.3V: R30.2 R31.2 R32.2
GND: J2.2 SW2.3 SW3.3
BT_Pairing_PB: R31.1 SW3.2 ; off-sheet BT_Pairing_PB
Reed_Switch: J2.1 R32.1 ; off-sheet Reed_Switch
Toggle_Display_PB: R30.1 SW2.2 ; off-sheet Toggle_Display_PB

Not connected (* = marked no-connect by the designer): SW2 1 4; SW3 1 4

### Library data of the parts
J2 = 1935161: TERM BLK 2POS SIDE ENTRY 5MM PCB; Mfr_Name: Phoenix Contact; Copyright: Copyright (C) 2022 Ultra Librarian. All rights reserved.; Manufacturer_Part_Number: 1935161; Digi-Key_Part_Number_1: 277-1667-ND; RefDes: RefDes; Type: DEV; Supplier 1: Digi-Key
R30-R32 = CMP-1659-00013-4: Chip Resistor, 10 KOhm, +/- 1%, 0.125 W, -55 to 155 degC, 0805 (2012 Metric), RoHS, Tape and Reel; Manufacturer: Yageo; Voltage Rating: 150 V; Temperature Coefficient: 100ppm/°C; Power Rating: 125mW; Mount: Surface Mount; ComponentLink1Description: Manufacturer URL; ComponentLink2URL: http://www.yageo.com/documents/recent/PYu-RC_Group_51_RoHS_L_04.pdf; Pins: 2; Length: 2 mm; Min Operating Temperature: -55 degC; Height: 0.5 mm; Mounting Technology: Surface Mount; RoHSCompliant: true; REACH SVHC: No SVHC; ComponentLink1URL: http://www.yageo.com/; Max Operating Temperature: 155 degC; PackageReference: 0805; DatasheetVersion: Rev. 4, 02/2016; Package Quantity: 5000; Packaging: Tape and Reel; ComponentLink2Description: Datasheet; PackageDescription: 2-Pin Surface Mounted Device, Body 2 x 1.25 mm; Supplier 1: Digi-Key; Supplier Part Number 1: 311-10.0KCRCT-ND; Manufacturer 1: Yageo; Manufacturer Part Number 1: RC0805FR-0710KL; RoHS: Yes; Category: Chip SMD Resistors; Stock 1: 5682818; Pricing 1: 1=0.10000, 10=0.03800, 100=0.01560, 1000=0.00702, 2500=0.00610 (USD); Case/Package: 0805; Case Code (Imperial): 0805; Case Code (Metric): 2012; Size Code: 0805; Tolerance: 1%; Resistor Type: Thick Film; Series: RC; Number of Terminations: 2; Max Power Dissipation: 125mW; Termination: SMD/SMT; Features: Moisture Resistant; Construction: Rectangular; Resistance Tolerance: 1%; Technology: THICK FILM; Width: 0.049inch; Depth: 1.25mm; RoHS Compliant: Yes; Military Standard: Not; Lead Free: Lead Free; ComponentLink3URL: https://datasheet.ciiva.com/11808/0900766b8106beab-11808151.pdf?src-supplier=RSComponents; ComponentLink3Description: https://datasheet.ciiva.com/11808/0900766b8106beab-11808151.pdf?src-supplier=RSComponents; ComponentLink4URL: https://datasheet.ciiva.com/46447/444164-46447563.pdf?src-supplier=Element14; ComponentLink4Description: https://datasheet.ciiva.com/46447/444164-46447563.pdf?src-supplier=Element14; ComponentLink5URL: https://datasheet.ciiva.com/2456/pyu-r-int-thick-7-2456973.pdf?src-supplier=Digi-Key; ComponentLink5Description: https://datasheet.ciiva.com/2456/pyu-r-int-thick-7-2456973.pdf?src-supplier=Digi-Key; ComponentLink6URL: https://datasheet.ciiva.com/2456/pyu-r-int-thick-7-2456974.pdf?src-supplier=Digi-Key; ComponentLink6Description: https://datasheet.ciiva.com/2456/pyu-r-int-thick-7-2456974.pdf?src-supplier=Digi-Key; ComponentLink7URL: https://datasheet.ciiva.com/2456/pyu-r-int-thick-7-2456972.pdf?src-supplier=Digi-Key; ComponentLink7Description: https://datasheet.ciiva.com/2456/pyu-r-int-thick-7-2456972.pdf?src-supplier=Digi-Key; ComponentLink8URL: https://datasheet.ciiva.com/12669/rc0805-12669688.pdf?src-supplier=Mouser; ComponentLink8Description: https://datasheet.ciiva.com/12669/rc0805-12669688.pdf?src-supplier=Mouser; ComponentLink9URL: https://datasheet.ciiva.com/16747/rc0805-16747087.pdf?src-supplier=Future+Electronics; ComponentLink9Description: https://datasheet.ciiva.com/16747/rc0805-16747087.pdf?src-supplier=Future+Electronics
SW2 SW3 = CMP-2000-05602-2: Swicth, SPST, 24 V, -35 to 85 degC, 4-Pin SMD, RoHS, Tape and Reel; Manufacturer: TE Connectivity; Switch Travel: 0.25mm; Mechanical Life: 100000Cycles; Contact Current Rating: 50mA; Operating Force: 1.57N; Actuator Material: Polyamide; Contact Resistance: 100mOhm; Voltage Rating: 24V; Illumination Type: Illuminated; Actuator Length: 0.055inch; Max Voltage Rating (DC): 12V; Case\/Package: SMD/SMT; Switch Function: Off-Mom; Actuator Type: Standard; Insulation Resistance: 100MR; Orientation: Straight; Datasheet URL: http://www.te.com/commerce/DocumentDelivery/DDEController?Action=showdoc&DocId=Customer+Drawing%7F2-1437565-7%7FV%7Fpdf%7FEnglish%7FENG_CD_2-1437565-7_V.pdf%7F4-1437565-2; Min Operating Temperature: -35degC; Packaging: LoosePiece; Termination: GullWing; Throw Configuration: SPST; Package Description: 4-Pin Surface Mount Device, Body 6 x 6 mm, Pitch 4.5 mm; Mounting Technology: SurfaceMount; Contact Plating: Silver; Datasheet Version: Rev. V, 02/2015; RoHSCompliant: true; Max Operating Temperature: 85degC; Length: 6mm; Voltage Rating (DC): 24V; Electrical Life: 100000Cycles; Current Rating: 50mA; Package Quantity: 750; Mount: SurfaceMount; Package Reference: FSM4JSMA; Manufacturer URL: http://www.te.com/; Width: 6mm; REACH SVHC: Unknown; Contact Material: CopperAlloy; Supplier 1: Digi-Key; Supplier Part Number 1: 450-1129-ND; Manufacturer 1: TE Connectivity; Manufacturer Part Number 1: FSM4JSMA; RoHS: Yes; Category: Pushbutton Switches; Stock 1: 65608; Pricing 1: 1=0.27000, 10=0.26300, 25=0.24960, 100=0.22600, 250=0.20604, 750=0.19152, 1500=0.16339, 3000=0.15885, 5250=0.14977 (USD); Case/Package: SMD/SMT; Color: Black; Series: FSMJSMA; Max Current Rating: 50mA; Depth: 10mm; Radiation Hardening: No; RoHS Compliant: Yes; Lead Free: Lead Free; ELV: Compliant

## Nets that join several sheets
3.3V: 02-MCU (12 pins), 03_Seven_Seg (12 pins), 05-SD_Card (C5.1 J1.4), 06-GPS (6 pins), 07-3V3_Monitor (U2.3), 08-Power_3V3 (C8.1 TP6.1 U3.4), 09-Transmitter (7 pins), 10-Push_Buttons (R30.2 R31.2 R32.2)
GND: 02-MCU (18 pins), 03_Seven_Seg (C1.2 C2.2 C3.2 C4.2), 04_Seven_Seg (16 pins), 05-SD_Card (C5.2 J1.6 J1.15), 06-GPS (13 pins), 07-3V3_Monitor (R28.1 U2.2), 08-Power_3V3 (5 pins), 09-Transmitter (10 pins), 10-Push_Buttons (J2.2 SW2.3 SW3.3)
3V3_PWR_GOOD: 02-MCU (U200.1), 07-3V3_Monitor (D2.2 U2.1)
ASK: 02-MCU (MD200.8), 09-Transmitter (R29.2 U4.1)
BT_Pairing_PB: 02-MCU (MD200.28), 10-Push_Buttons (R31.1 SW3.2)
DIG0_N: 02-MCU (MD200.11), 03_Seven_Seg (Q4.1 R4.1)
DIG1_N: 02-MCU (MD200.10), 03_Seven_Seg (Q3.1 R3.1)
DIG2_N: 02-MCU (MD200.34), 03_Seven_Seg (Q2.1 R2.1)
DIG3_N: 02-MCU (MD200.35), 03_Seven_Seg (Q1.1 R1.1)
GPS_RX: 02-MCU (MD200.12), 06-GPS (R24.2 R26.2 TP3.1)
GPS_SCL: 02-MCU (MD200.13), 06-GPS (R25.2 R27.2 TP4.1)
MISO: 02-MCU (MD200.40), 05-SD_Card (J1.7 TP_MISO1.1)
MOSI: 02-MCU (MD200.39), 05-SD_Card (J1.3 TP_MOSI1.1)
Reed_Switch: 02-MCU (MD200.29), 10-Push_Buttons (J2.1 R32.1)
RESET: 02-MCU (LED200.1 MD200.42 TP200.1 U201.4), 06-GPS (U1.18)
SCLK: 02-MCU (MD200.38), 05-SD_Card (J1.5 TP_SCLK1.1)
SEG_A: 03_Seven_Seg (DS1.7 DS2.7 DS3.7 DS4.7), 04_Seven_Seg (R5.2)
SEG_B: 03_Seven_Seg (DS1.6 DS2.6 DS3.6 DS4.6), 04_Seven_Seg (R6.2)
SEG_C: 03_Seven_Seg (DS1.4 DS2.4 DS3.4 DS4.4), 04_Seven_Seg (R7.2)
SEG_D: 03_Seven_Seg (DS1.2 DS2.2 DS3.2 DS4.2), 04_Seven_Seg (R8.2)
SEG_DP: 03_Seven_Seg (DS2.5), 04_Seven_Seg (R18.2)
SEG_E: 03_Seven_Seg (DS1.1 DS2.1 DS3.1 DS4.1), 04_Seven_Seg (R9.2)
SEG_EN_A: 02-MCU (MD200.17), 04_Seven_Seg (Q5.1 R11.2)
SEG_EN_B: 02-MCU (MD200.18), 04_Seven_Seg (Q6.1 R12.2)
SEG_EN_C: 02-MCU (MD200.21), 04_Seven_Seg (Q7.1 R13.2)
SEG_EN_D: 02-MCU (MD200.9), 04_Seven_Seg (Q8.1 R14.2)
SEG_EN_DP: 02-MCU (MD200.31), 04_Seven_Seg (Q12.1 R20.2)
SEG_EN_E: 02-MCU (MD200.14), 04_Seven_Seg (Q9.1 R15.2)
SEG_EN_F: 02-MCU (MD200.19), 04_Seven_Seg (Q10.1 R16.2)
SEG_EN_G: 02-MCU (MD200.20), 04_Seven_Seg (Q11.1 R19.2)
SEG_F: 03_Seven_Seg (DS1.9 DS2.9 DS3.9 DS4.9), 04_Seven_Seg (R10.2)
SEG_G: 03_Seven_Seg (DS1.10 DS2.10 DS3.10 DS4.10), 04_Seven_Seg (R17.2)
SS0: 02-MCU (MD200.37), 05-SD_Card (J1.2 TP_SS1.1)
Toggle_Display_PB: 02-MCU (MD200.30), 10-Push_Buttons (R30.1 SW2.2)